# EAGLE design fonte-diagrama (EAGLE 9.6.2)
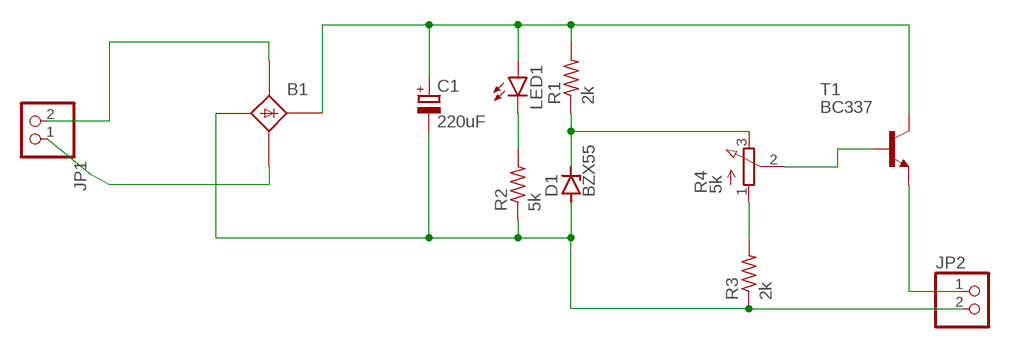
[diagram p0: schematic, sheet 1]

## Parts
B1  B25A-  [B25A-]
C1  220uF  CPOL-EUE10-20  [EB20D]
D1  BZX55  [DO35Z10]
JP1  PINHD-1X2  [1X02]
JP2  PINHD-1X2  [1X02]
LED1  LED5MM  [LED5MM]
R1  2k  R-US_0207/10  [0207/10]
R2  5k  R-US_0207/10  [0207/10]
R3  2k  R-US_0207/10  [0207/10]
R4  5k  3RP/1610N  [3RP/1610N]
T1  BC337  [TO92]

## Nets
N$1: B1.AC1-(AC1) JP1.2
N$2: B1.AC2-(AC2) JP1.1
N$3: B1.+1(+) C1.+ LED1.A R1.2 T1.3(C)
N$4: B1.-1(-) C1.- D1.A JP2.2 R2.1 R3.1
N$5: LED1.K(C) R2.2
N$6: D1.C R1.1 R4.3(E)
N$7: R3.2 R4.1(A)
N$8: R4.2(S) T1.2(B)
N$9: JP2.1 T1.1(E)
Unconnected: B1.+ B1.- B1.AC1 B1.AC2

## Library data of the parts
B1 = rectifier:B25A-: RECTIFIER 25-A bridge; SPICEPREFIX: X
C1 = rcl:CPOL-EU: POLARIZED CAPACITOR, European symbol; SPICEPREFIX: C
D1 = diode:BZX55: Z DIODE
JP1 JP2 = pinhead:PINHD-1X2: PIN HEADER
LED1 = led:LED: LED OSRAM: - CHIPLED LG R971, LG N971, LY N971, LG Q971, LY Q971, LO R971, LY R971 LH N974, LH R974 LS Q976, LO Q976, LY Q976 LO Q996 - Hyper CHIPLED LW Q18S LB Q993, LB Q99A, LB R99A - SideLED LS A670, LO A670, LY A670, LG A670, LP A670 LB A673, LV A673, LT A673, LW A673 LH A674 LY A675 LS A676, LA A676, LO A676, LY A676, LW A676 LS A679, LY A679, LG A679 - Hyper Micro SIDELED® LS Y876, LA Y876, LO Y876, LY Y876 LT Y87S - SmartLED LW L88C, LW L88S LB L89C, LB L89S, LG L890 LS L89K, LO L89K, LY L89K LS L896, LA L896, LO L896, LY L896 - TOPLED LS T670, LO T670, LY T670, LG T670, LP T670 LSG T670, LSP T670, LSY T670, LOP T670, LYG T670 LG T671, LOG T671, LSG T671 LB T673, LV T673, LT T673, LW T673 LH T674 LS T676, LA T676, LO T676, LY T676, LB T676, LH T676, LSB T676, LW T676 LB T67C, LV T67C, LT T67C, LS T67K, LO T67K, LY T67K, LW E67C LS E67B, LA E67B, LO E67B, LY E67B, LB E67C, LV E67C, LT E67C LW T67C LS T679, LY T679, LG T679 LS T770, LO T770, LY T770, LG T770, LP T770 LB T773, LV T773, LT T773, LW T773 LH T774 LS E675, LA E675, LY E675, LS T675 LS T776, LA T776, LO T776, LY T776, LB T776 LHGB T686 LT T68C, LB T68C - Hyper Mini TOPLED® LB M676 - Mini TOPLED Santana® LG M470 LS M47K, LO M47K, LY M47K Source: http://www.osram.convergy.de LUXEON: - LUMILED® LXK2-PW12-R00, LXK2-PW12-S00, LXK2-PW14-U00, LXK2-PW14-V00 LXK2-PM12-R00, LXK2-PM12-S00, LXK2-PM14-U00 LXK2-PE12-Q00, LXK2-PE12-R00, LXK2-PE12-S00, LXK2-PE14-T00, LXK2-PE14-U00 LXK2-PB12-K00, LXK2-PB12-L00, LXK2-PB12-M00, LXK2-PB14-N00, LXK2-PB14-P00, LXK2-PB14-Q00 LXK2-PR12-L00, LXK2-PR12-M00, LXK2-PR14-Q00, LXK2-PR14-R00 LXK2-PD12-Q00, LXK2-PD12-R00, LXK2-PD12-S00 LXK2-PH12-R00, LXK2-PH12-S00 LXK2-PL12-P00, LXK2-PL12-Q00, LXK2-PL12-R00 Source: www.luxeon.com KINGBRIGHT: KA-3528ASYC Source: www.kingbright.com
R1-R3 = rcl:R-US_: RESISTOR, American symbol; SPICEPREFIX: R
R4 = pot:3RP/1610N: 16mm Potentiometer one level Source: http://www.alphapotentiometers.net/html/16mm_pot_2.html
T1 = transistor:BC337: NPN TRANSISTOR

## Net classes
0 default: width 0.762 mm, drill 0.762 mm, clearance 0.254 mm

## Board
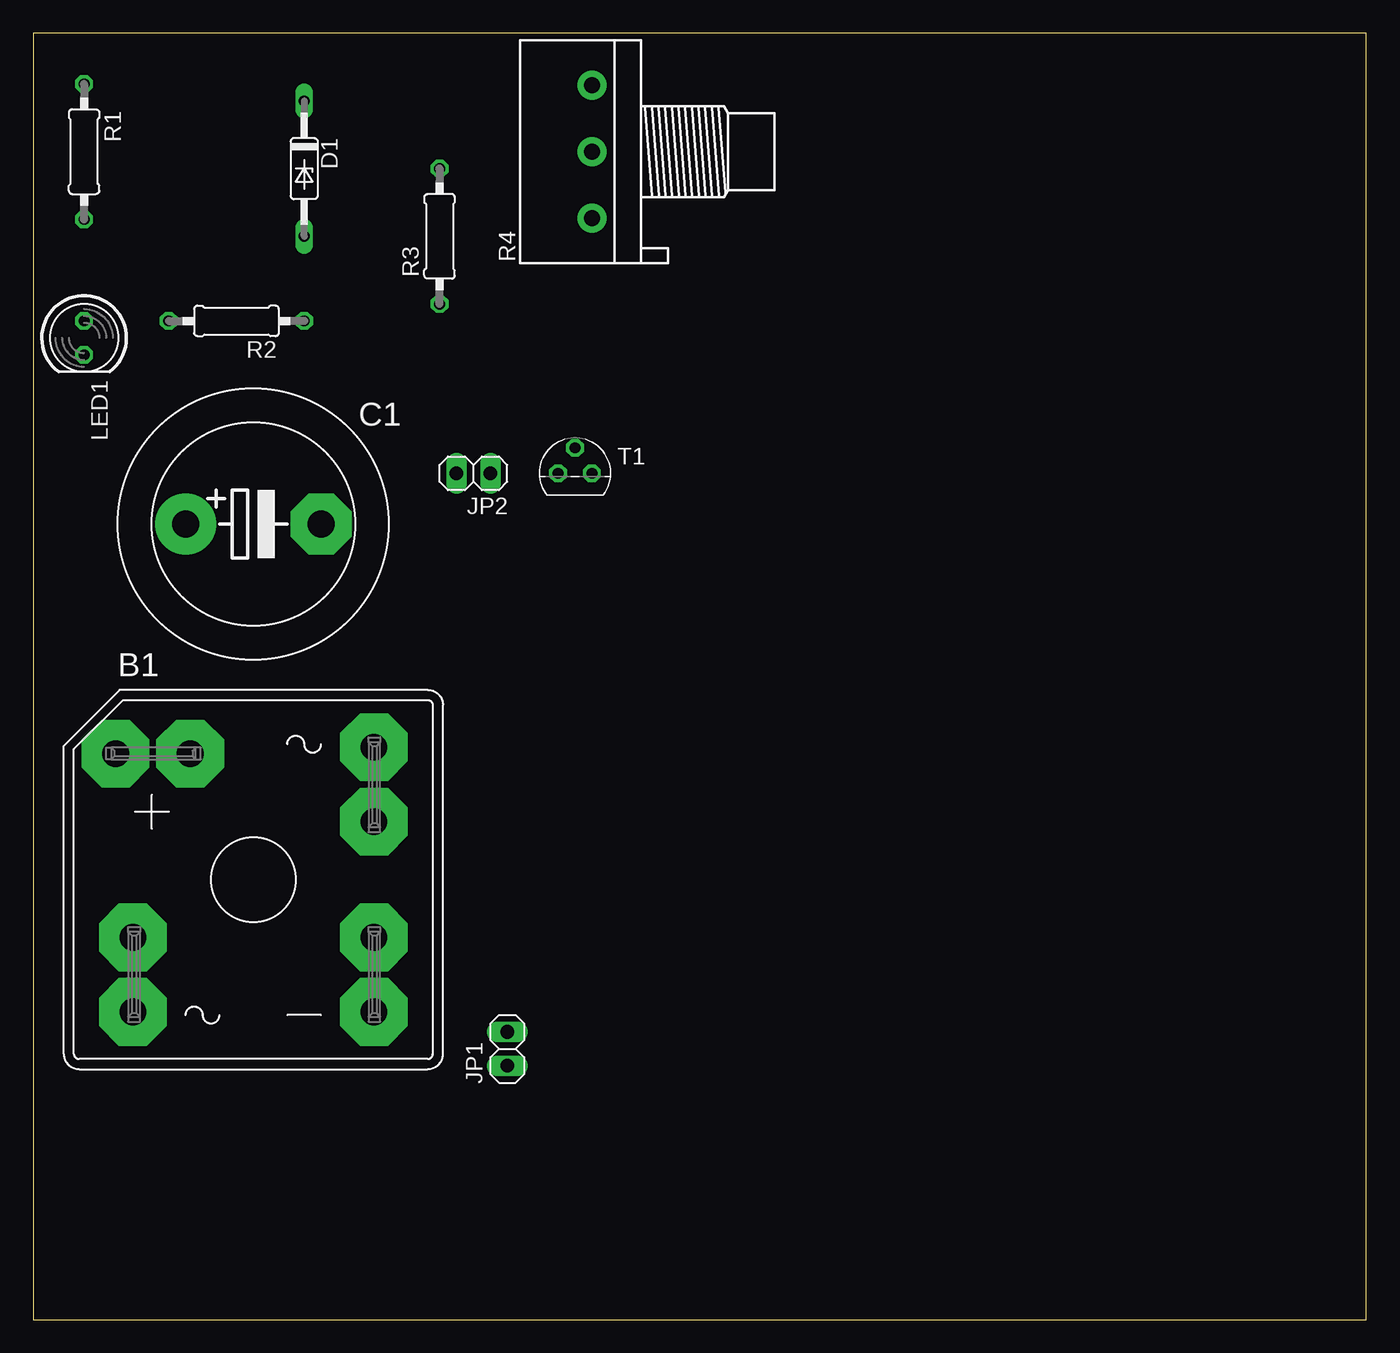
[diagram p1: board, top side]
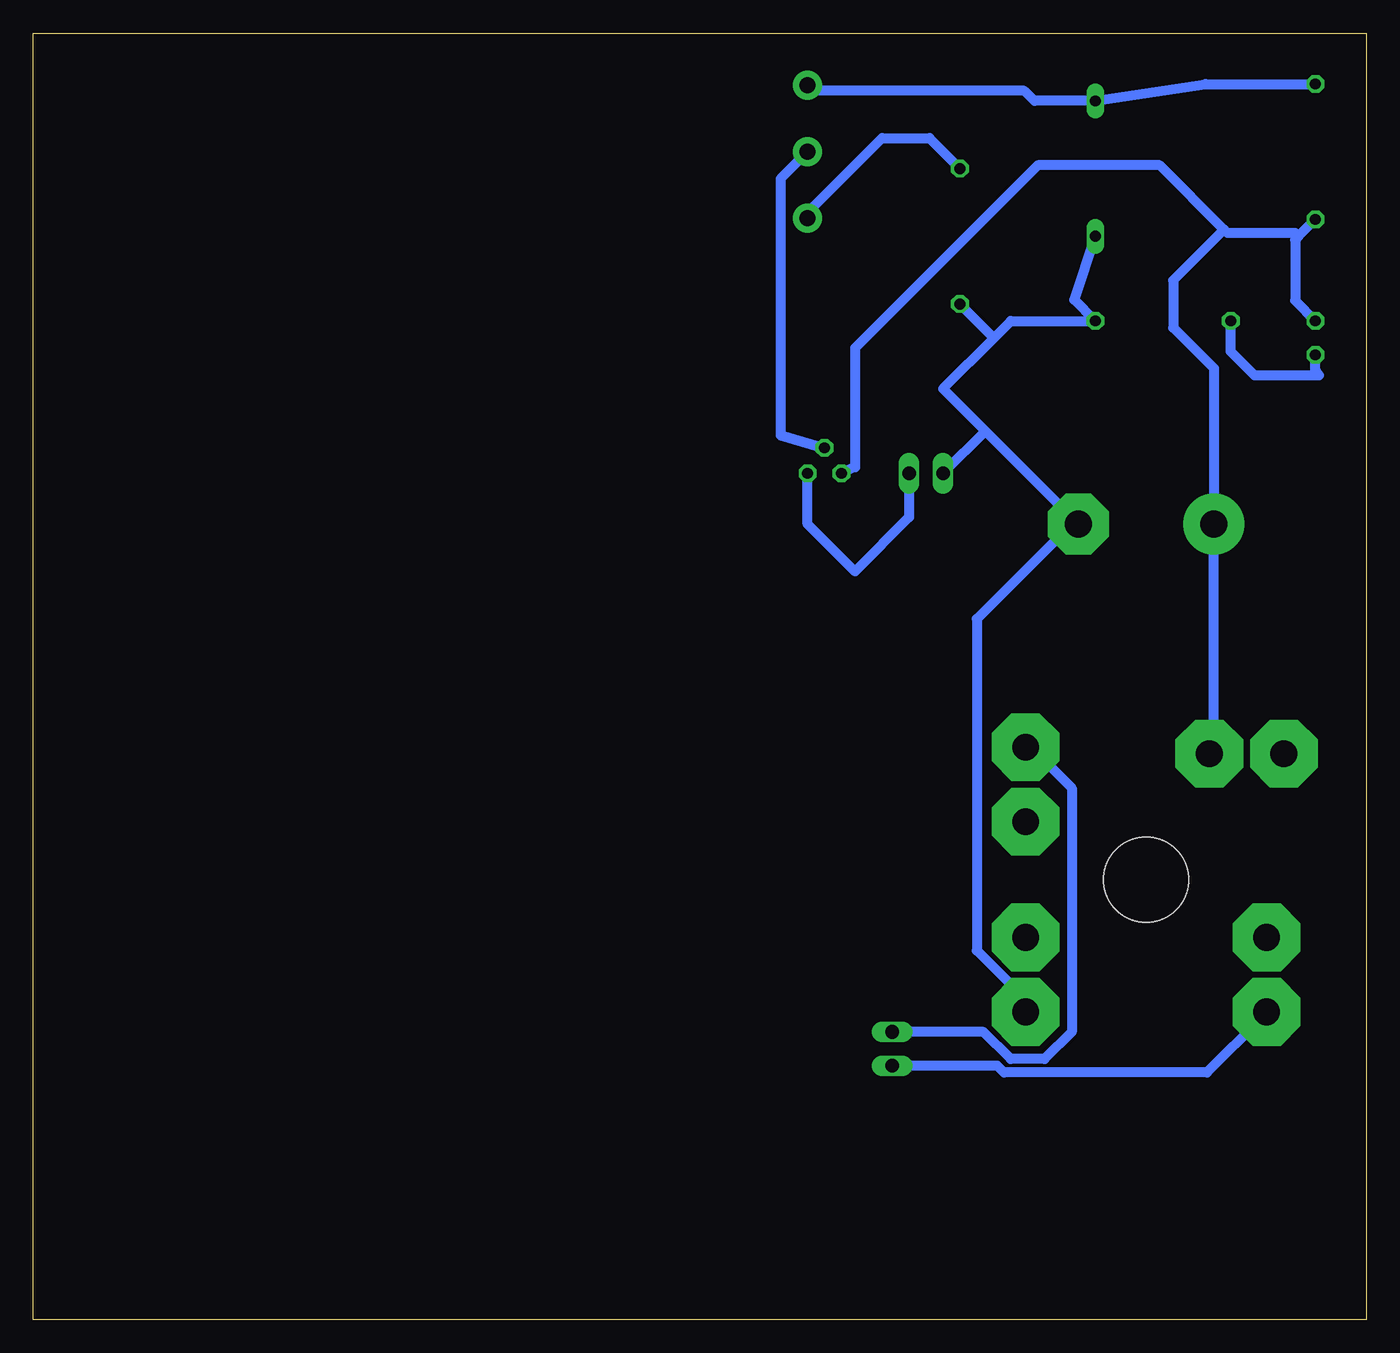
[diagram p2: board, bottom side, seen from below]

Size 100 x 96.51 mm. Coordinates in mm from the lower left corner, seen from the top.
Outline: 0,0 100,0 100,96.51 0,96.51 0,0
Copper layers (1*16): Top 0.035mm / dielectric 1.5mm / Bottom 0.035mm
Design rules "default": minimum track width 6mil, minimum drill 0.35mm, track to track 6mil, track to pad 6mil, pad to pad 6mil, via to via 6mil, smd to smd 6mil, copper to edge 40mil, drill to drill 6mil, minimum pad ring 10mil, minimum via ring 8mil, stop-mask expansion 4mil, vias tented up to drill 0mil, thermal gap 10mil

### Footprints (pad centres in the part's own frame; a part is rotated, then mirrored left to right if it is on the bottom)
B25A- = drill 2.007 pad 5.08 octagon: + -10.338,9.449; +1 -4.75,9.449; - 9.042,-4.343; -1 9.042,-9.931; AC1 9.042,4.343; AC1- 9.042,9.931; AC2 -9.042,-4.343; AC2- -9.042,-9.931 | hole 6.401: 0,0
EB20D = drill 2.007 pad 4.597: + -5.08,0 | drill 2.007 pad 4.597 octagon: - 5.08,0
DO35Z10 = drill 0.813 long: A 5.08,0; C -5.08,0
1X02 = drill 1.016 long: 1 -1.27,0; 2 1.27,0
LED5MM = drill 0.813 octagon: A -1.27,0; K 1.27,0
0207/10 = drill 0.813 octagon: 1 -5.08,0; 2 5.08,0
3RP/1610N = drill 1.2 pad 2.184: 1 -5,0; 2 0,0; 3 5,0
TO92 = drill 0.813 octagon: 1 1.27,0; 2 0,1.905; 3 -1.27,0

### Placement (x,y rotation side)
B1  16.51,33.02 0 top
C1  16.51,59.69 0 top
D1  20.32,86.36 270 top
JP1  35.56,20.32 90 top
JP2  33.02,63.5 180 top
LED1  3.81,73.66 270 top
R1  3.81,87.63 270 top
R2  15.24,74.93 180 top
R3  30.48,81.28 90 top
R4  41.91,87.63 90 top
T1  40.64,63.5 0 top

### Tracks (layer width: path | path; a pad name or v marks a point on that pad's centre or on a via)
N$1
  Bottom 0.762: JP1.2 28.7,21.59 26.67,19.56 24.13,19.56 22.1,21.59 22.1,39.88 25.15,42.93 B1.AC1-
N$2
  Bottom 0.762: JP1.1 27.69,19.05 27.18,18.54 11.94,18.54 7.87,22.61 B1.AC2-
N$3
  Bottom 0.762: B1.+1 11.43,42.93 C1.+ 11.43,71.37 14.48,74.42 14.48,77.98 10.67,81.79 | LED1.A 5.33,76.45 5.33,81.03 5.08,81.28 | R1.2 5.08,81.28 | T1.3 38.35,63.96 38.35,72.9 24.64,86.61 15.49,86.61 10.67,81.79 | 10.67,81.79 10.41,81.53 5.33,81.53 5.08,81.28
N$4
  Bottom 0.762: R3.1 27.94,73.66 | D1.A 21.91,76.52 R2.1 26.67,74.93 27.94,73.66 | 27.94,73.66 31.75,69.85 28.57,66.67 | 28.57,66.67 JP2.2 | 28.57,66.67 C1.- 22.1,59.69 29.21,52.58 29.21,27.69 25.65,24.13 25.65,23.11 B1.-1
N$5
  Bottom 0.762: LED1.K 3.81,71.25 3.56,70.87 8.38,70.87 10.16,72.64 R2.2
N$6
  Bottom 0.762: R1.1 12.06,92.71 D1.C 24.89,91.44 25.65,92.2 41.91,92.2 R4.3
N$7
  Bottom 0.762: R3.2 32.77,88.65 36.32,88.65 41.91,83.06 R4.1
N$8
  Bottom 0.762: R4.2 43.94,85.6 43.94,66.36 T1.2
N$9
  Bottom 0.762: T1.1 41.91,59.69 38.35,56.13 34.29,60.2 JP2.1